# EAGLE design main (EAGLE 6.3)
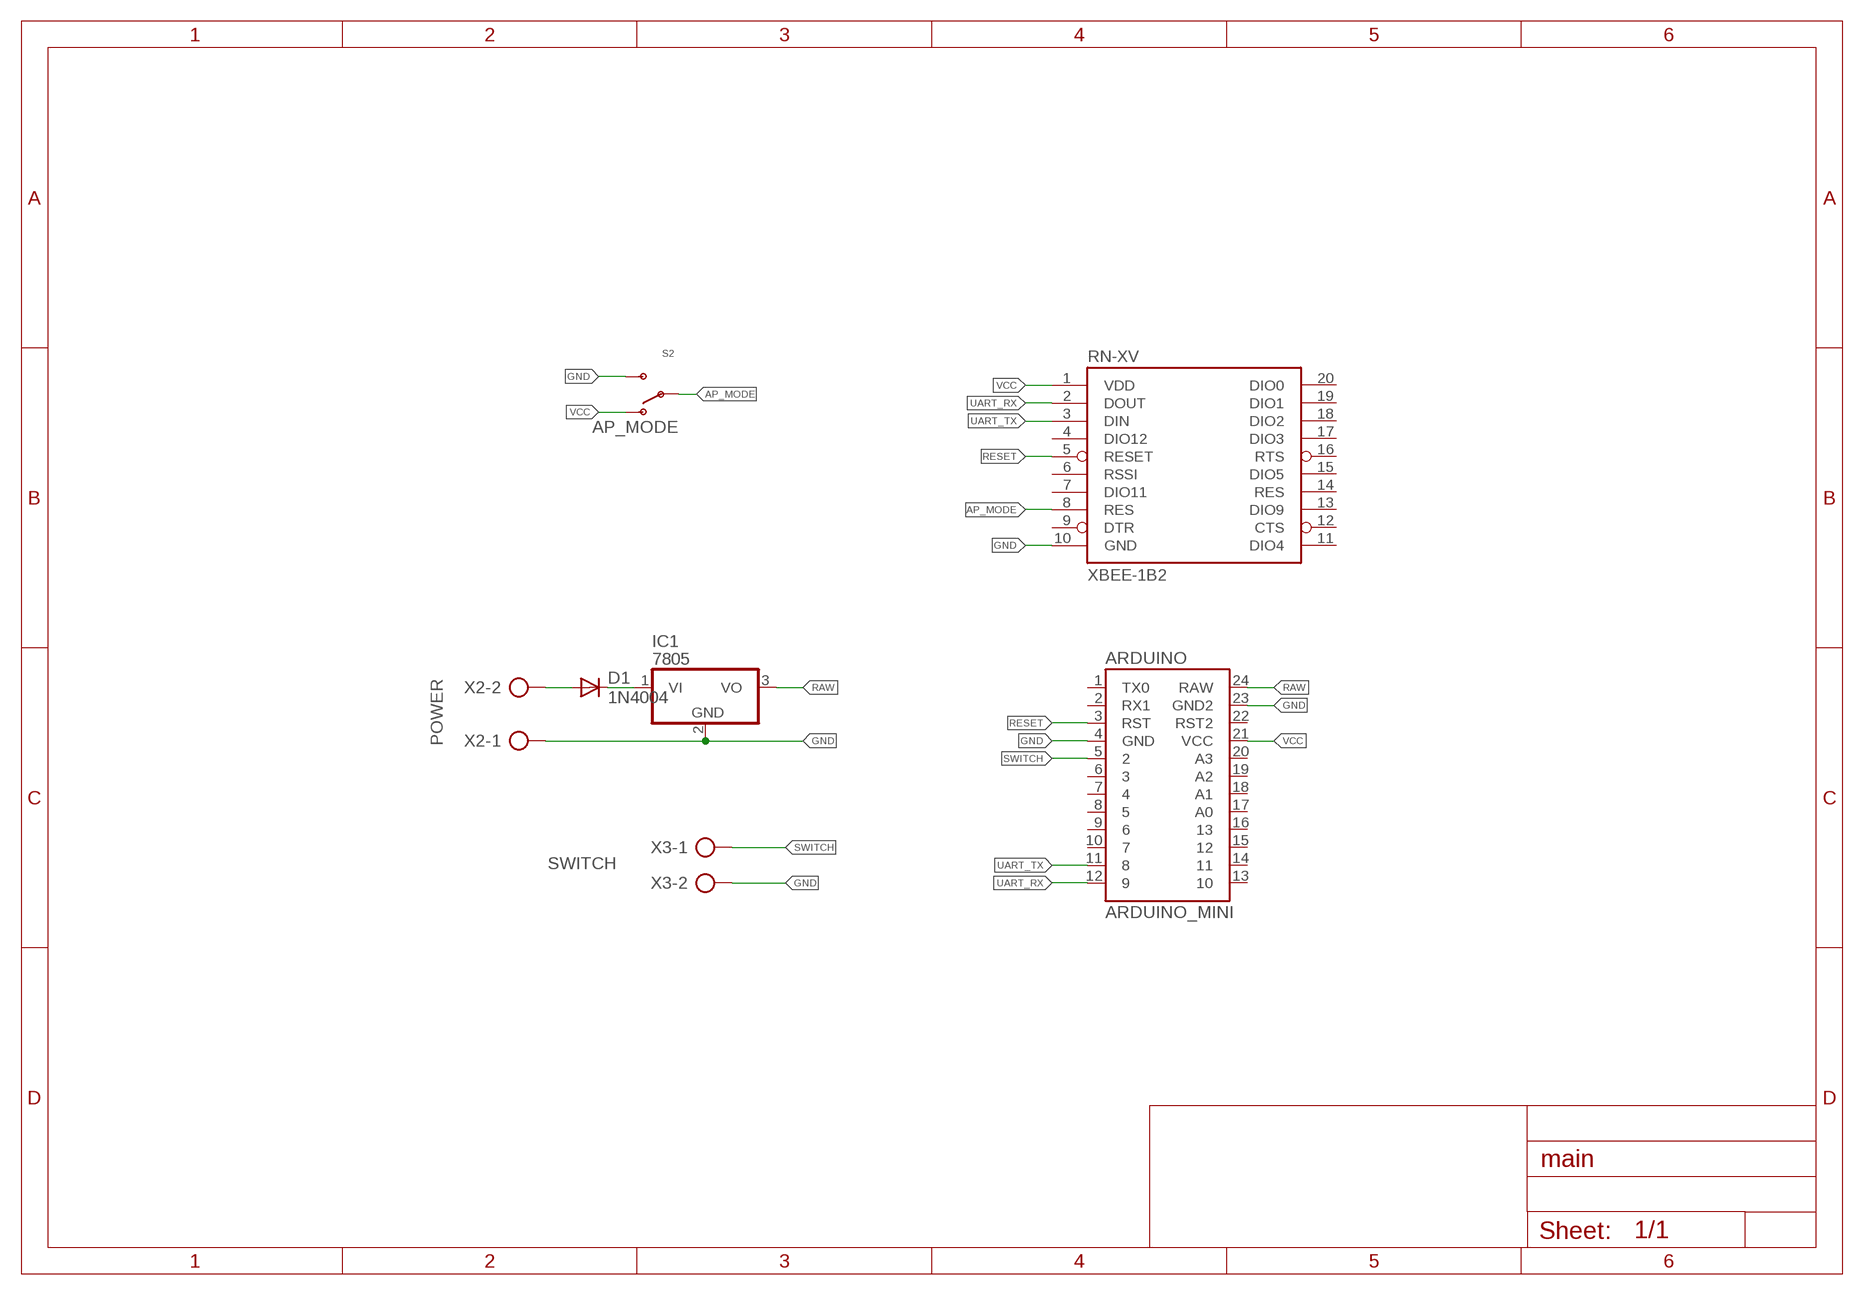
[diagram p0: schematic, sheet 1]

## Parts
ARDUINO  ARDUINO_MINI  [ARDUINO_MINI]
D1  1N4004  [DO41-10]
IC1  7805  786TV  [TO220V]
RN-XV  XBEE-1B2  [XBEE-SILK]
S2  AP_MODE  SWITCH-SPDTPTH  [SWITCH-SPDT]
X2  POWER  AK500/2  [AK500/2]
X3  SWITCH  AK500/2  [AK500/2]

## Nets
AP_MODE: RN-XV.8(RES) S2.2(P)
GND: ARDUINO.4(GND) ARDUINO.23(GND2) IC1.2(GND) RN-XV.10(GND) S2.3(S) X2.1 X3.2
N$1: D1.A X2.2
N$2: D1.C IC1.1(VI)
RAW: ARDUINO.24(RAW) IC1.3(VO)
RESET: ARDUINO.3(RST) RN-XV.5(RESET)
SWITCH: ARDUINO.5 X3.1
UART_RX: ARDUINO.12 RN-XV.2(DOUT)
UART_TX: ARDUINO.11 RN-XV.3(DIN)
VCC: ARDUINO.21(VCC) RN-XV.1(VDD) S2.1(O)
Unconnected: ARDUINO.1(TX0) ARDUINO.2(RX1) ARDUINO.6 ARDUINO.7 ARDUINO.8 ARDUINO.9 ARDUINO.10 ARDUINO.13 ARDUINO.14 ARDUINO.15 ARDUINO.16 ARDUINO.17(A0) ARDUINO.18(A1) ARDUINO.19(A2) ARDUINO.20(A3) ARDUINO.22(RST2) RN-XV.4(DIO12) RN-XV.6(RSSI) RN-XV.7(DIO11) RN-XV.9(DTR) RN-XV.11(DIO4) RN-XV.12(CTS) RN-XV.13(DIO9) RN-XV.14(RES) RN-XV.15(DIO5) RN-XV.16(RTS) RN-XV.17(DIO3) RN-XV.18(DIO2) RN-XV.19(DIO1) RN-XV.20(DIO0)

## Library data of the parts
ARDUINO = SparkFun-Boards:ARDUINO_MINI: Arduino Pro Mini footprint
D1 = diode:1N4004: DIODE general purpose rectifier, 1 A
IC1 = linear:78*: Positive VOLTAGE REGULATOR Source: http://cache.national.com/ds/LM/LM78L05.pdf http://www.fairchildsemi.com/ds/LM/LM7805.pdf
RN-XV = SparkFun-RF:XBEE-1: Xbee module footprints SMT header is CONN-09042.
S2 = SparkFun-Electromechanical:SWITCH-SPDT: SPST Switch Simple slide switch. Spark Fun Electronics SKU : COM-00102
X2 X3 = con-ptr500:AK500/2: CONNECTOR; OC_FARNELL: unknown; OC_NEWARK: unknown

## Board
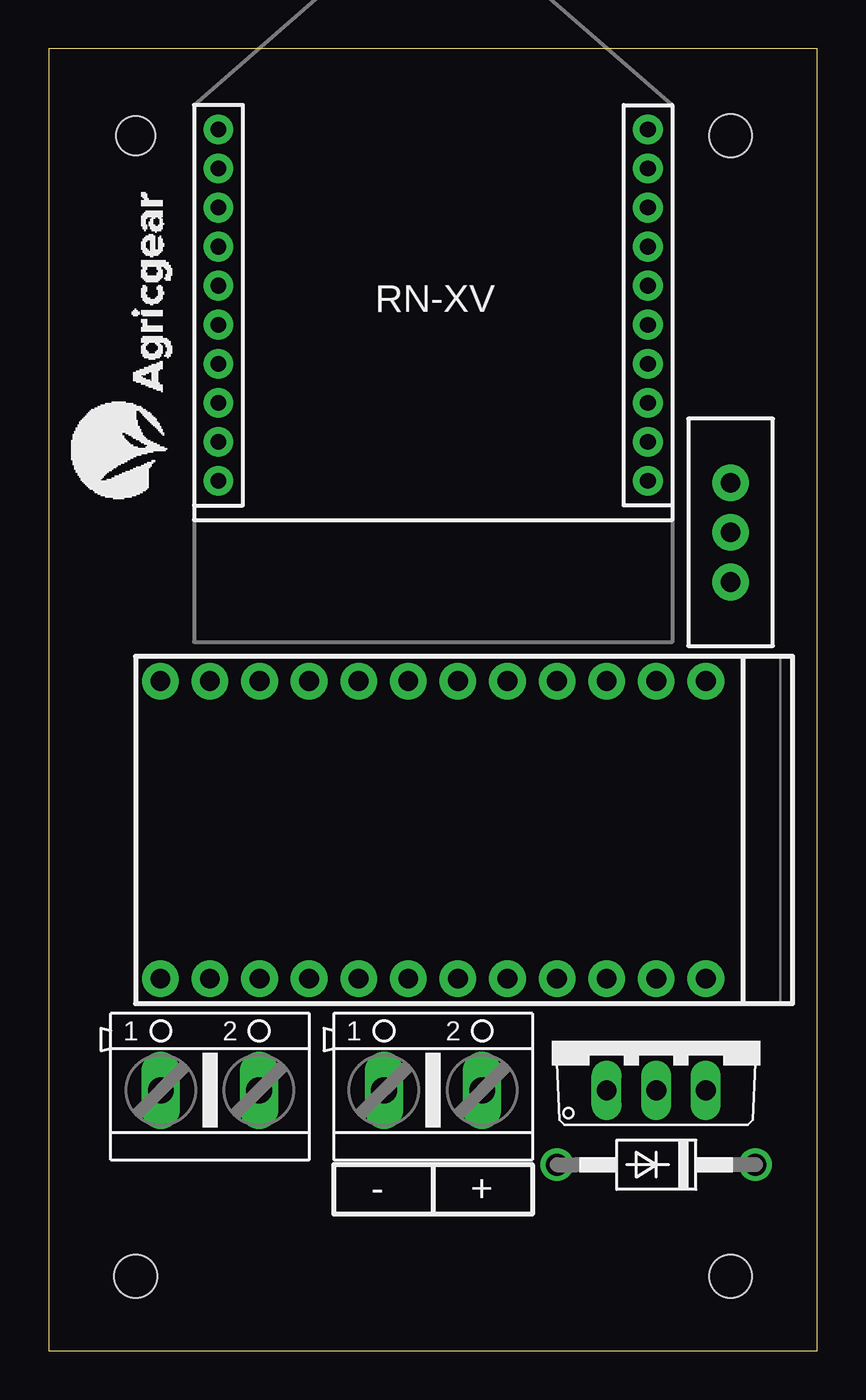
[diagram p1: board, top side]
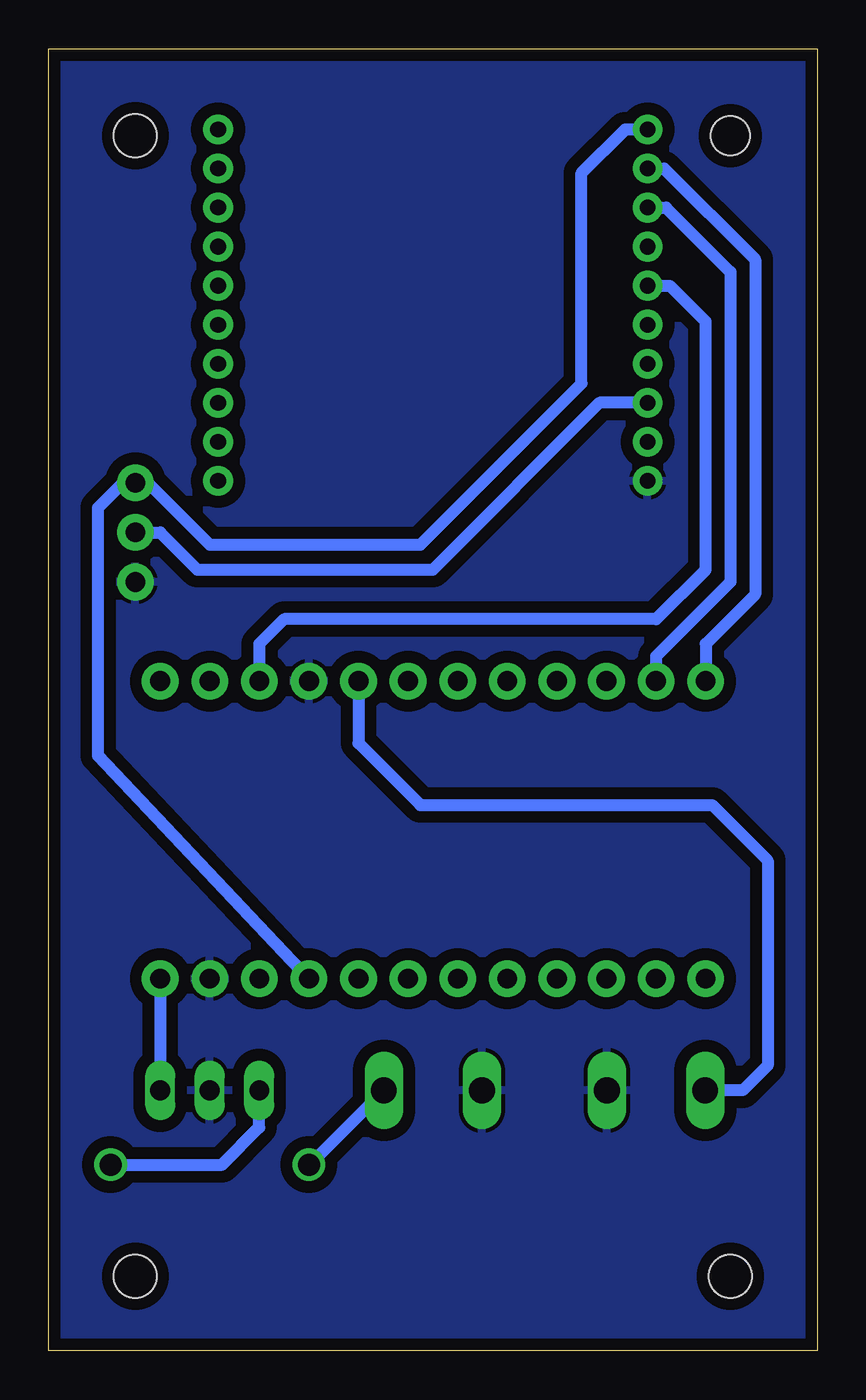
[diagram p2: board, bottom side, seen from below]

Size 39.36 x 66.67 mm. Coordinates in mm from the lower left corner, seen from the top.
Outline: 0,66.67 0,0 39.36,0 39.36,66.67 0,66.67
Copper layers (1*16): Top 0.035mm / dielectric 1.5mm / Bottom 0.035mm
Design rules "PCBCart-Standard": minimum track width 8mil, minimum drill 0.4mm, track to track 8mil, track to pad 8mil, pad to pad 8mil, via to via 8mil, smd to smd 8mil, copper to edge 20mil, drill to drill 8mil, minimum pad ring 8mil, minimum via ring 10mil, stop-mask expansion 3mil, vias tented up to drill 0mil, thermal gap 8mil
Holes 2 mm at 4.45,62.23
Holes 2.2 mm at 4.45,3.81 34.92,62.23 34.92,3.81

### Footprints (pad centres in the part's own frame; a part is rotated, then mirrored left to right if it is on the bottom)
ARDUINO_MINI = drill 1.016 pad 1.88: 1 -7.62,12.7; 2 -7.62,10.16; 3 -7.62,7.62; 4 -7.62,5.08; 5 -7.62,2.54; 6 -7.62,0; 7 -7.62,-2.54; 8 -7.62,-5.08; 9 -7.62,-7.62; 10 -7.62,-10.16; 11 -7.62,-12.7; 12 -7.62,-15.24; 13 7.62,-15.24; 14 7.62,-12.7; 15 7.62,-10.16; 16 7.62,-7.62; 17 7.62,-5.08; 18 7.62,-2.54; 19 7.62,0; 20 7.62,2.54; 21 7.62,5.08; 22 7.62,7.62; 23 7.62,10.16; 24 7.62,12.7
DO41-10 = drill 1.118: A 5.08,0; C -5.08,0
TO220V = drill 1.016 long: 1 -2.54,-2.54; 2 0,-2.54; 3 2.54,-2.54
XBEE-SILK = drill 0.8 pad 1.524: 1 -11,20; 2 -11,18; 3 -11,16; 4 -11,14; 5 -11,12; 6 -11,10; 7 -11,8; 8 -11,6; 9 -11,4; 10 -11,2; 11 11,2; 12 11,4; 13 11,6; 14 11,8; 15 11,10; 16 11,12; 17 11,14; 18 11,16; 19 11,18; 20 11,20
SWITCH-SPDT = drill 1.016 pad 1.88: 1 0,2.54; 2 0,0; 3 0,-2.54
AK500/2 = drill 1.321 long: 1 -2.515,0; 2 2.515,0

### Placement (x,y rotation side)
ARDUINO  20.95,26.67 270 top
D1  31.11,9.53 180 top
IC1  31.11,15.88 0 top
RN-XV  19.68,42.55 0 top
S2  34.92,41.91 0 top
U$4  [LOGO_AGROGUIA_SILK]  6.35,43.81 90 top
X2  19.68,13.34 0 top
X3  8.26,13.34 0 top

### Tracks (layer width: path | path; a pad name or v marks a point on that pad's centre or on a via)
AP_MODE
  Bottom 0.61: S2.2 33.66,41.91 31.75,40.01 19.68,40.01 11.14,48.55 RN-XV.8
GND
  pour Bottom (isolate 0.61): 39.37,66.67 39.37,0 0,0 0,66.67
N$1
  Bottom 0.61: D1.A 26.01,9.53 X2.2
N$2
  Bottom 0.61: D1.C 30.48,9.53 28.57,11.43 IC1.1
RAW
  Bottom 0.61: ARDUINO.24 IC1.3
RESET
  Bottom 0.61: ARDUINO.3 28.57,36.2 27.3,37.47 8.26,37.47 5.71,40.01 5.71,52.7 7.55,54.55 RN-XV.5
SWITCH
  Bottom 0.61: ARDUINO.5 23.5,31.11 20.32,27.94 5.38,27.94 2.54,25.1 2.54,14.61 3.81,13.34 X3.1
UART_RX
  Bottom 0.61: ARDUINO.12 5.71,36.2 3.17,38.73 3.17,55.88 7.84,60.55 RN-XV.2
UART_TX
  Bottom 0.61: ARDUINO.11 8.26,35.56 4.45,39.37 4.45,55.24 7.75,58.55 RN-XV.3
VCC
  Bottom 0.61: RN-XV.1 9.85,62.55 12.06,60.33 12.06,49.53 20.32,41.27 31.11,41.27 34.29,44.45 S2.1 35.56,44.45 36.83,43.18 36.83,30.48 ARDUINO.21 26.04,18.41

### Text on the board
tPlace: - | +